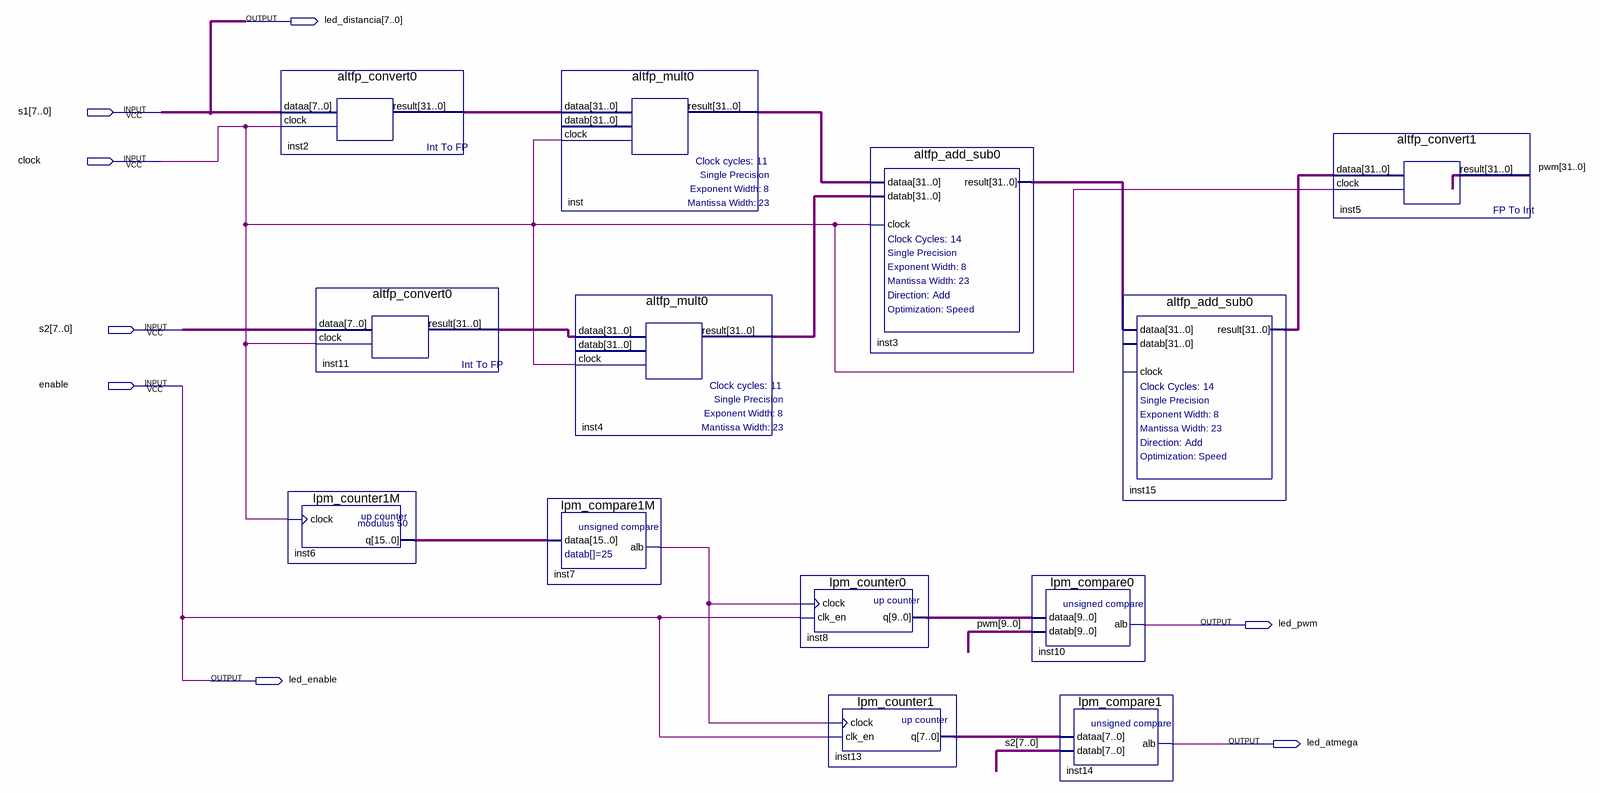
[diagram p0: schematic sheet]
// Quartus schematic final.bdf as structural Verilog: 13 symbols, 8 pins
module \final  (
  input  [7:0] s1,
  input  clock,
  input  [7:0] s2,
  input  enable,
  output [7:0] led_distancia,
  output led_pwm,
  output led_enable,
  output led_atmega
);

  wire inst7_alb;
  wire [7:0] inst13_q;
  wire [9:0] inst8_q;
  wire [15:0] inst6_q;
  wire [31:0] inst2_result, inst3_result, inst4_result, inst11_result, inst15_result, inst_result, pwm;

  altfp_convert0 inst2 (.dataa(s1), .clock(clock), .result(inst2_result));
  lpm_counter1M inst6 (.clock(clock), .q(inst6_q));
  altfp_convert0 inst11 (.dataa(s2), .clock(clock), .result(inst11_result));
  altfp_mult0 inst (.dataa(inst2_result), .clock(clock), .result(inst_result));  // open: datab
  altfp_mult0 inst4 (.dataa(inst11_result), .clock(clock), .result(inst4_result));  // open: datab
  lpm_compare1M inst7 (.dataa(inst6_q), .alb(inst7_alb));
  lpm_counter0 inst8 (.clock(inst7_alb), .clk_en(enable), .q(inst8_q));
  lpm_counter1 inst13 (.clock(inst7_alb), .clk_en(enable), .q(inst13_q));
  altfp_add_sub0 inst3 (.dataa(inst_result), .datab(inst4_result), .clock(clock), .result(inst3_result));
  lpm_compare0 inst10 (.dataa(inst8_q), .datab(pwm[9:0]), .alb(led_pwm));
  lpm_compare1 inst14 (.dataa(inst13_q), .datab(s2), .alb(led_atmega));
  altfp_add_sub0 inst15 (.dataa(inst3_result), .result(inst15_result));  // open: datab, clock
  altfp_convert1 inst5 (.dataa(inst15_result), .clock(clock), .result(pwm));

  assign led_distancia = s1;
  assign led_enable = enable;
endmodule
